# Altium schematic sheet Connectors_&_Switch_Buttons.SchDoc
size 431 x 279 mm; Organization: ORGANIZATION; Address1: ADDRESS 1; Address2: ADDRESS 2; Address3: ADDRESS 3; Address4: ADDRESS 4; Revision: -; SheetNumber: 3; SheetTotal: 4; ENG_APP_DATE: --/--/--; DSN_APP_DATE: --/--/--; CHK_APP_DATE: --/--/--
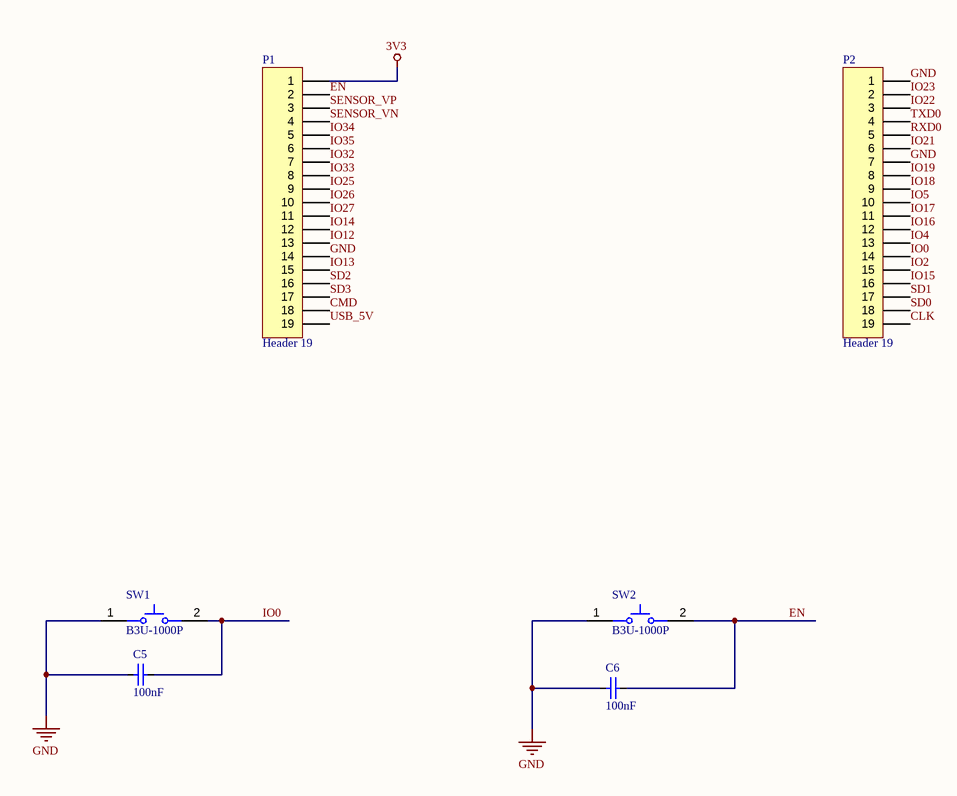
[diagram p0: Connectors_&_Switch_Buttons.SchDoc]

## Parts
C5  value 100nF  [0603C_L]  (hidden comment: Cap100nF_50V_0603)
C6  value 100nF  [0603C_L]  (hidden comment: Cap100nF_50V_0603)
P1  Header 19  [HDR1X19]
P2  Header 19  [HDR1X19]
SW1  B3U-1000P  [OMRON-B3U-1000_V]
SW2  B3U-1000P  [OMRON-B3U-1000_V]

## Nets
3V3: P1.1
GND: C5.1 C6.1 P1.14 P2.1 P2.7 SW1.1 SW2.1
CLK: P2.19
CMD: P1.18
EN: C6.2 P1.2 SW2.2
IO0: C5.2 P2.14 SW1.2
IO2: P2.15
IO4: P2.13
IO5: P2.10
IO12: P1.13
IO13: P1.15
IO14: P1.12
IO15: P2.16
IO16: P2.12
IO17: P2.11
IO18: P2.9
IO19: P2.8
IO21: P2.6
IO22: P2.3
IO23: P2.2
IO25: P1.9
IO26: P1.10
IO27: P1.11
IO32: P1.7
IO33: P1.8
IO34: P1.5
IO35: P1.6
RXD0: P2.5
SD0: P2.18
SD1: P2.17
SD2: P1.16
SD3: P1.17
SENSOR_VN: P1.4
SENSOR_VP: P1.3
TXD0: P2.4
USB_5V: P1.19

## Notes on the sheet
- DWG. NO.
- REV.
- SHT.
- THIS DOCUMENT AND THE DATA DISCLOSED HEREIN OR HEREWITH IS THE PROPERTY OF ALTIUM LIMITED AND MAY BE FREELY DISTRIBUTED IN WHOLE. NO RIGHTS ARE RESERVED OR EXPRESS OR IMPLIED WARANTEE GIVEN.
- REVISION
- DESCRIPTION
- DATE
- APPROVED
- ENG:
- DSN:
- APPROVALS
- PROJECT REVISION:
- www.altium.com <http://www.altium.com>
- DOCUMENT REVISION:
- 92037, La Jolla
- USA
- Altium Ltd.
- 4225 Executive Square
- CHK:
- REFERENCE DOCUMENTS
- DESIGN ITEM:
- TITLE
- VARIANT
- BOM:
- FAB DWG:
- PCB DWG:
- ASSY DWG:
- SCALE:
- SIZE
- B
- CAGE CODE
- FILE NAME
- DWG NO.
- SHEET
- OF
- REV

## Library data of the parts
C5 C6 = CMP-001-00084-1: Ceramic Capacitor, Multilayer, Ceramic, 50V, 80% +Tol, 20% -Tol, Y5V, -82/+22% TC, 0.1uF, Surface Mount, 0603; Manufacturer: Yageo; Manufacturer Part Number: CC0603ZRY5V9BB104; Multilayer: Yes; Source: WCT.SCHLIB; Voltage Rating: 50V; Design Item ID: Cap100nF_50V_0603; Tolerance (fill in as +-): 80%; Packaging: Tape and Reel; Mounting Technology: Surface Mount; Pins: 2; Termination: Wraparound; Capacitor Type: Ceramic; Height: 0.8mm; Reach SVHC Compliant: Yes; Rated DC Voltage (URdc): 50V; RoHS Compliant: Yes; Package Style: SMTMeter; Tolerance  (fill in as +-): 20%; Length: 1.6mm; Case/Package: 0603; JESD-609 Code: e3; Component Type: Capacitors; Terminal Finish: Nickel; Max Operating Temperature: 85°C; Min Operating Temperature: -30°C; Dielectric Material: Ceramic; Temperature Characteristics Code: Y5V; Package Shape: Rectangular; Width: 0.8mm
P1 P2 = Header 19: Header, 19-Pin; LatestRevisionDate: 17-Jul-2002; LatestRevisionNote: Re-released for DXP Platform.; Publisher: Altium Limited
SW1 SW2 = CMP-011-00000-2: Tactile Switch, SPST-NO, 0.05 A, 12 V, -25 to 70 degC, 2-Pin SMD, RoHS, Tape and Reel; Manufacturer: Omron Electronic Components; IP Rating: IP40; Current Rating: 50mA; Max Contact Resistance: 100mohm; Operating Force: 153gf; Throw Configuration: SPST; Resistance: 0.1Ohm; Max Voltage Rating (DC): 12V; Contact Material: Silver; Max Current Rating: 50mA; Datasheet URL: http://www.omron.com/ecb/products/pdf/en-b3u.pdf; Mounting Technology: SM; Case/Package: B3U-1000; Packaging: TapeandReel; Package Reference: B3U-1000; Manufacturer URL: http://www.omron.com/; Datasheet Version: Jan-15; RoHS Compliant: True; Max Operating Temperature: 70°C; Contact Current Rating: 50mA; Package Quantity: 3500; Package Description: 2-Pin Surface Mount Device, Body 3 x 2.5 mm; Voltage Rating (DC): 12V; Min Operating Temperature: -25°C; Voltage Rating: 12V